# EAGLE design MySensors D1 mini (EAGLE 6.1)
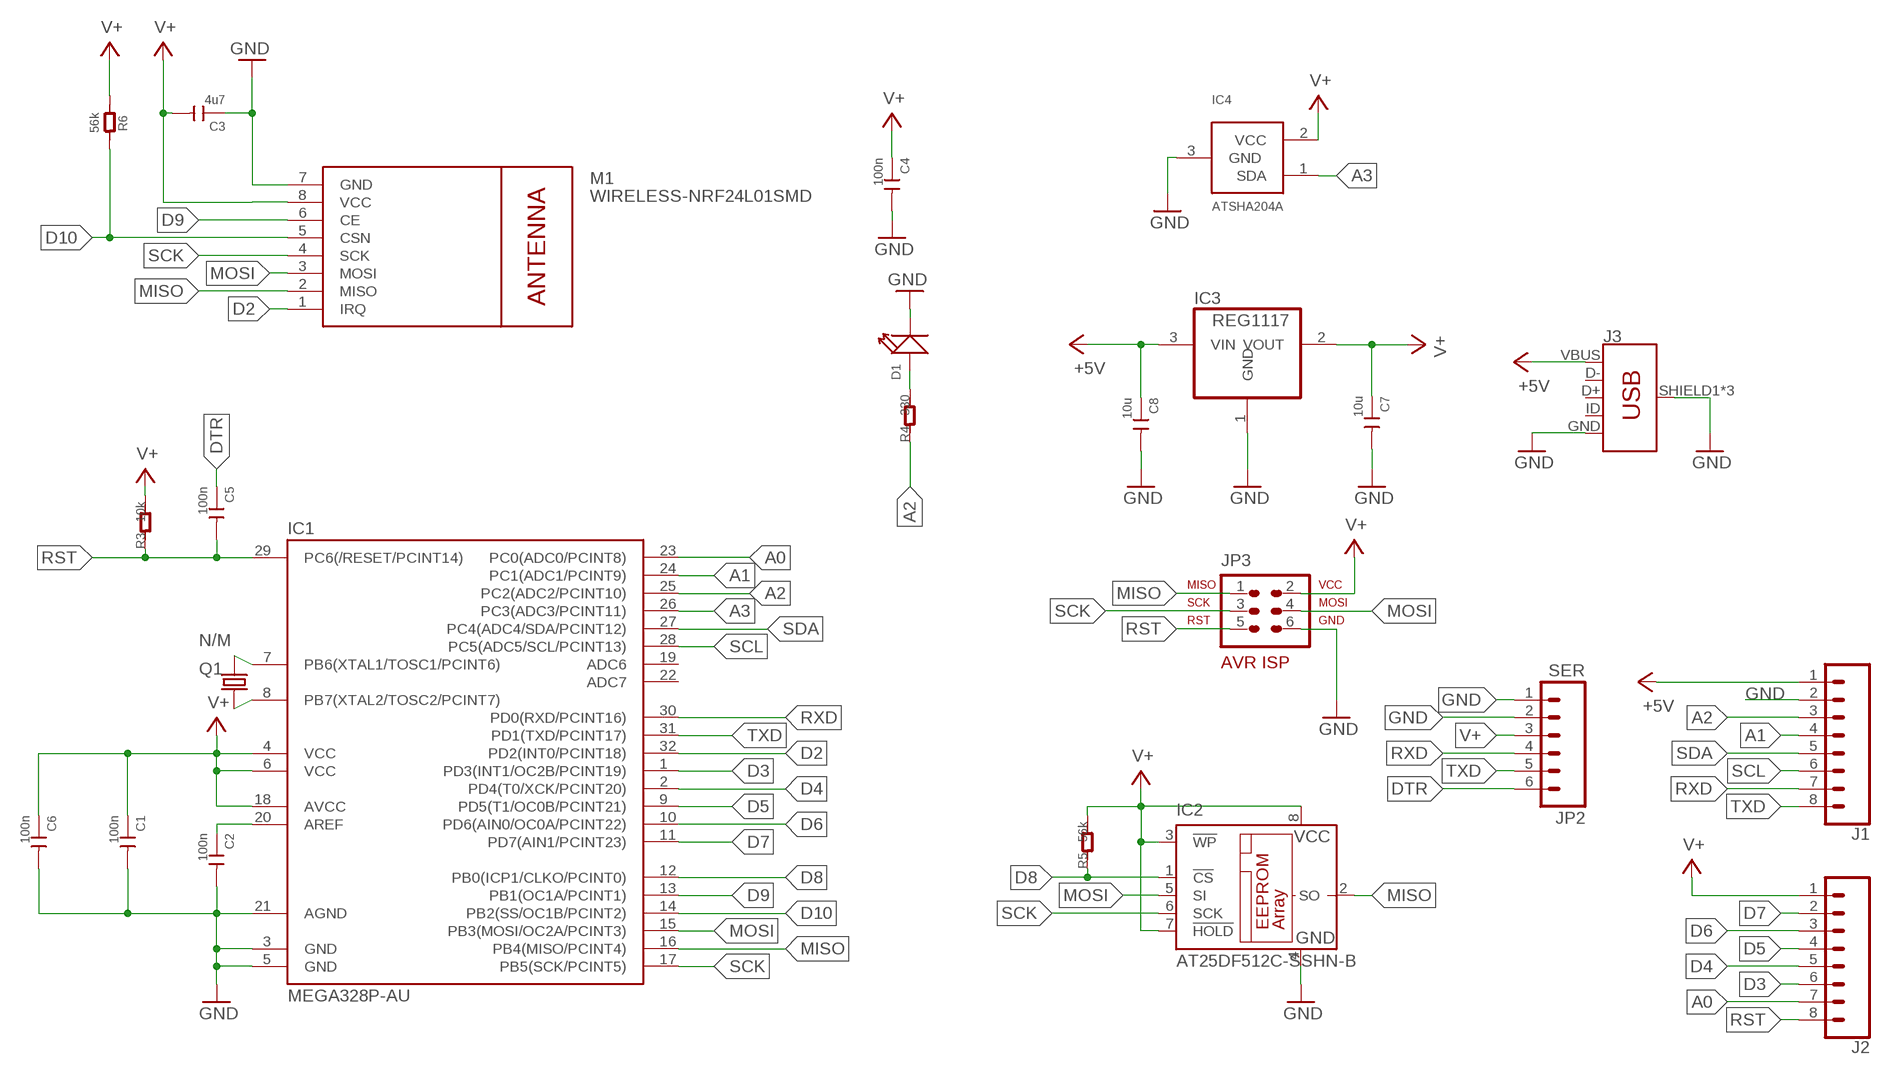
[diagram p0: schematic, sheet 1]

## Parts
C1  100n  CAP-0402  [C0402]
C2  100n  CAP-0402  [C0402]
C3  4u7  CAP-0603  [C0603]
C4  100n  CAP-0402  [C0402]
C5  100n  CAP-0402  [C0402]
C6  100n  CAP-0402  [C0402]
C7  10u  CAP-1206  [C1206]
C8  10u  CAP-1206  [C1206]
D1  LED-0402  [LED-0402]
IC1  MEGA328P-AU  MEGA48/88/168-AU  [TQFP32-08]
IC2  AT25DF512C-SSHN-B  25AA080SN  [SO-08]
IC3  REG1117  [SOT223]
IC4  ATSHA204A  [SOT23]
J1  CONN_08"  [1X08]
J2  CONN_08"  [1X08]
J3  USB_MICRO-B_FEMALE-SMT  [USB-B-MICRO-SMD]
JP2  SER  M06NO_SILK_FEMALE_PTH  [1X06_NO_SILK]
JP3  N/M  AVR-ISP-6VERT  [AVR-ISP-6]
M1  WIRELESS-NRF24L01SMD  [WIRELESS-NRF24L01-SMD]
Q1  N/M  CRYSTAL-306010055  [2P-L3.2XW1.5MM]
R3  10k  R-0402  [R0402]
R4  330  R-0402  [R0402]
R5  56k  R-0402  [R0402]
R6  56k  R-0402  [R0402]

## Nets
+5V [Power]: C8.1 IC3.3(VIN) J1.1 J3.VBUS
A0: IC1.23(PC0(ADC0/PCINT8)) J2.7
A1: IC1.24(PC1(ADC1/PCINT9)) J1.4
A2: IC1.25(PC2(ADC2/PCINT10)) J1.3 R4.1
A3: IC1.26(PC3(ADC3/PCINT11)) IC4.1(SDA)
D2: IC1.32(PD2(INT0/PCINT18)) M1.1(IRQ)
D3: IC1.1(PD3(INT1/OC2B/PCINT19)) J2.6
D4: IC1.2(PD4(T0/XCK/PCINT20)) J2.5
D5: IC1.9(PD5(T1/OC0B/PCINT21)) J2.4
D6: IC1.10(PD6(AIN0/OC0A/PCINT22)) J2.3
D7: IC1.11(PD7(AIN1/PCINT23)) J2.2
D8: IC1.12(PB0(ICP1/CLKO/PCINT0)) IC2.1(!CS) R5.1
D9: IC1.13(PB1(OC1A/PCINT1)) M1.6(CE)
D10: IC1.14(PB2(SS/OC1B/PCINT2)) M1.5(CSN) R6.1
DTR: C5.1 JP2.6
GND [Power]: C1.2 C2.2 C3.1 C4.2 C6.2 C7.2 C8.2 D1.- IC1.3(GND) IC1.5(GND) IC1.21(AGND) IC2.4(GND) IC3.1(GND) IC4.3(GND) J1.2 J3.GND J3.SHIELD1(SHIELD) J3.SHIELD2(SHIELD) J3.SHIELD3(SHIELD) JP2.1 JP2.2 JP3.6 M1.7(GND)
MISO: IC1.16(PB4(MISO/PCINT4)) IC2.2(SO) JP3.1 M1.2(MISO)
MOSI: IC1.15(PB3(MOSI/OC2A/PCINT3)) IC2.5(SI) JP3.4 M1.3(MOSI)
N$1: IC1.7(PB6(XTAL1/TOSC1/PCINT6)) Q1.1
N$2: IC1.8(PB7(XTAL2/TOSC2/PCINT7)) Q1.2
N$3: D1.+ R4.2
N$4: C2.1 IC1.20(AREF)
RST: C5.2 IC1.29(PC6(/RESET/PCINT14)) J2.8 JP3.5 R3.1
RXD: IC1.30(PD0(RXD/PCINT16)) J1.7 JP2.4
SCK: IC1.17(PB5(SCK/PCINT5)) IC2.6(SCK) JP3.3 M1.4(SCK)
SCL: IC1.28(PC5(ADC5/SCL/PCINT13)) J1.6
SDA: IC1.27(PC4(ADC4/SDA/PCINT12)) J1.5
TXD: IC1.31(PD1(TXD/PCINT17)) J1.8 JP2.5
V+ [Power]: C1.1 C3.2 C4.1 C6.1 C7.1 IC1.4(VCC) IC1.6(VCC) IC1.18(AVCC) IC2.3(!WP) IC2.7(!HOLD) IC2.8(VCC) IC3.2(VOUT) IC4.2(VCC) J2.1 JP2.3 JP3.2 M1.8(VCC) R3.2 R5.2 R6.2
Unconnected: IC1.19(ADC6) IC1.22(ADC7) J3.D+ J3.D- J3.ID

## Library data of the parts
C1-C8 = Discrete:CAP: Ceramic Capacitors
D1 = Discrete:LED
IC1 = avr-7:MEGA48/88/168
IC2 = microchip:25*: Serial EEPROM 4K/ 8K , SPI bus; MF: MICROCHIP; MPN: 25AA080/SN; OC_FARNELL: 1816072; OC_NEWARK: 92C7351
IC3 = burr-brown:REG1117: 800mA and 1A Low Dropout (LDO) Positive Regulator 1.8V, 2.5V, 2.85V, 3.3V, 5V, and Adj; MPN: REG1117; OC_FARNELL: 1097566; OC_NEWARK: 14P6981
IC4 = Sensor:ATSHA204A
J1 J2 = SparkFun-Connectors:CONN_08: Multi connection point. Often used as Generic Header-pin footprint for 0.1 inch spaced/style header connections On any of the 0.1 inch spaced packages, you can populate with these: Break Away Headers - Straight <https://www.sparkfun.com/products/116> (PRT-00116) Break Away Male Headers - Right Angle <https://www.sparkfun.com/products/553> (PRT-00553) Female Headers <https://www.sparkfun.com/products/115> (PRT-00115) Break Away Headers - Machine Pin <https://www.sparkfun.com/products/117> (PRT-00117) Break Away Female Headers - Swiss Machine Pin <https://www.sparkfun.com/products/743> (PRT-00743) Arduino Stackable Header - 8 Pin <https://www.sparkfun.com/products/9279> (PRT-09279) For SCREWTERMINALS and SPRING TERMINALS visit here: Screw Terimnals on SparkFun.com <https://www.sparkfun.com/search/results?term=Screw+Terminals> (5mm/3.5mm/2.54mm spacing) This device is also useful as a general connection point to wire up your design to another part of your project. Our various solder wires solder well into these plated through hole pads. Hook-Up Wire - Assortment (Stranded, 22 AWG) <https://www.sparkfun.com/products/11375> (PRT-11375) Hook-Up Wire - Assortment (Solid Core, 22 AWG) <https://www.sparkfun.com/products/11367> (PRT-11367) View the entire wire category on our website here <https://www.sparkfun.com/categories/141> Special notes: Molex polarized connector foot print use with SKU : PRT-08231 with associated crimp pins and housings. 1MM SMD Version SKU: PRT-10208 NOTES ON THE VARIANTS LOCK and LOCK_LONGPADS... This footprint was designed to help hold the alignment of a through-hole component (i.e. 6-pin header) while soldering it into place. You may notice that each hole has been shifted either up or down by 0.005 of an inch from it's more standard position (which is a perfectly straight line). This slight alteration caused the pins (the squares in the middle) to touch the edges of the holes. Because they are alternating, it causes a "brace" to hold the component in place. 0.005 has proven to be the perfect amount of "off-center" position when using our standard breakaway headers. Although looks a little odd when you look at the bare footprint, once you have a header in there, the alteration is very hard to notice. Also,if you push a header all the way into place, it is covered up entirely on the bottom side.; PROD_ID: CONN-08438
J3 = SparkFun-Connectors:USB_MICRO-B: USB Type Micro-B Connector Male/female and PTH/SMT variants SparkFun Products: SparkFun microB USB Breakout <https://www.sparkfun.com/products/12035> SparkFun USB microB Plug Breakout <https://www.sparkfun.com/products/10031> SparkFun ESP8266 Thing <https://www.sparkfun.com/products/13231>; PROD_ID: CONN-11752
JP2 = SparkFun-Connectors:M06: Header 6 Standard 6-pin 0.1" header. Use with straight break away headers (SKU : PRT-00116), right angle break away headers (PRT-00553), swiss pins (PRT-00743), machine pins (PRT-00117), and female headers (PRT-00115). Molex polarized connector foot print use with SKU : PRT-08094 with associated crimp pins and housings. NOTES ON THE VARIANTS LOCK and LOCK_LONGPADS... This footprint was designed to help hold the alignment of a through-hole component (i.e. 6-pin header) while soldering it into place. You may notice that each hole has been shifted either up or down by 0.005 of an inch from it's more standard position (which is a perfectly straight line). This slight alteration caused the pins (the squares in the middle) to touch the edges of the holes. Because they are alternating, it causes a "brace" to hold the component in place. 0.005 has proven to be the perfect amount of "off-center" position when using our standard breakaway headers. Although looks a little odd when you look at the bare footprint, once you have a header in there, the alteration is very hard to notice. Also,if you push a header all the way into place, it is covered up entirely on the bottom side. This idea of altering the position of holes to aid alignment will be further integrated into the Sparkfun Library for other footprints. It can help hold any component with 3 or more connection pins.; PROD_ID: CONN-08437
JP3 = avr-7:AVR-ISP-6: AVR ISP-6 Serial Programming Header
M1 = nrf24l01plus:WIRELESS-NRF24L01: 2.4 GHz Wireless Module based on NRF24L01 chip
Q1 = Discrete:CRYSTAL*
R3-R6 = Discrete:R*

## Net classes
0 default: width 0.203 mm
1 Power: width 0.406 mm

## Board
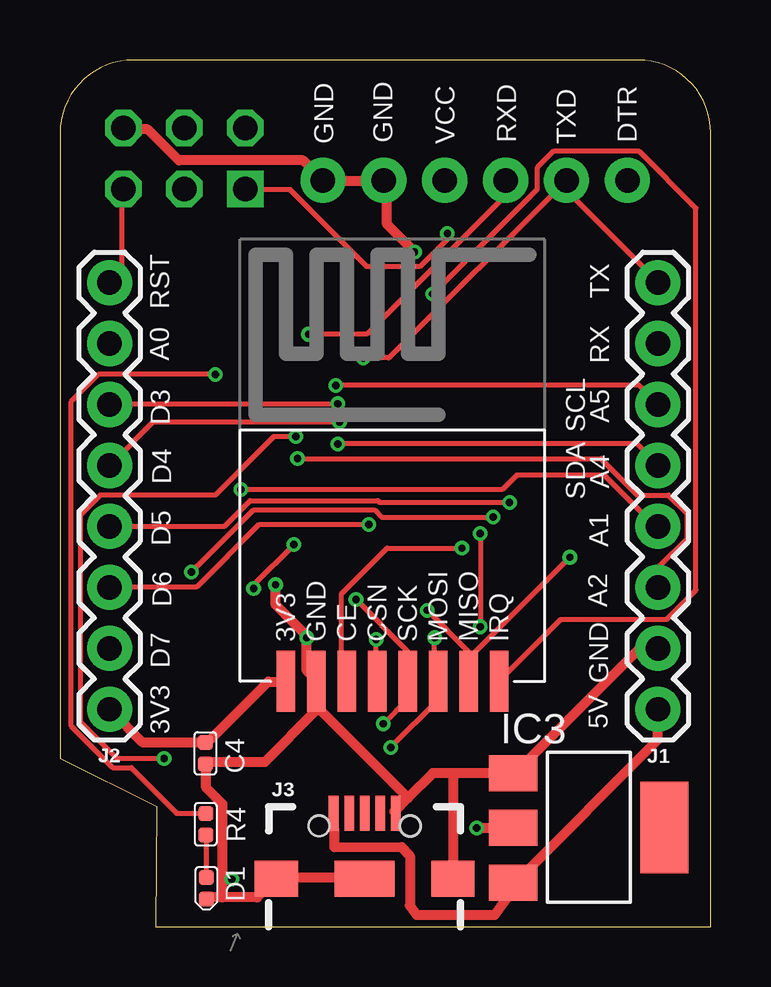
[diagram p1: board, top side]
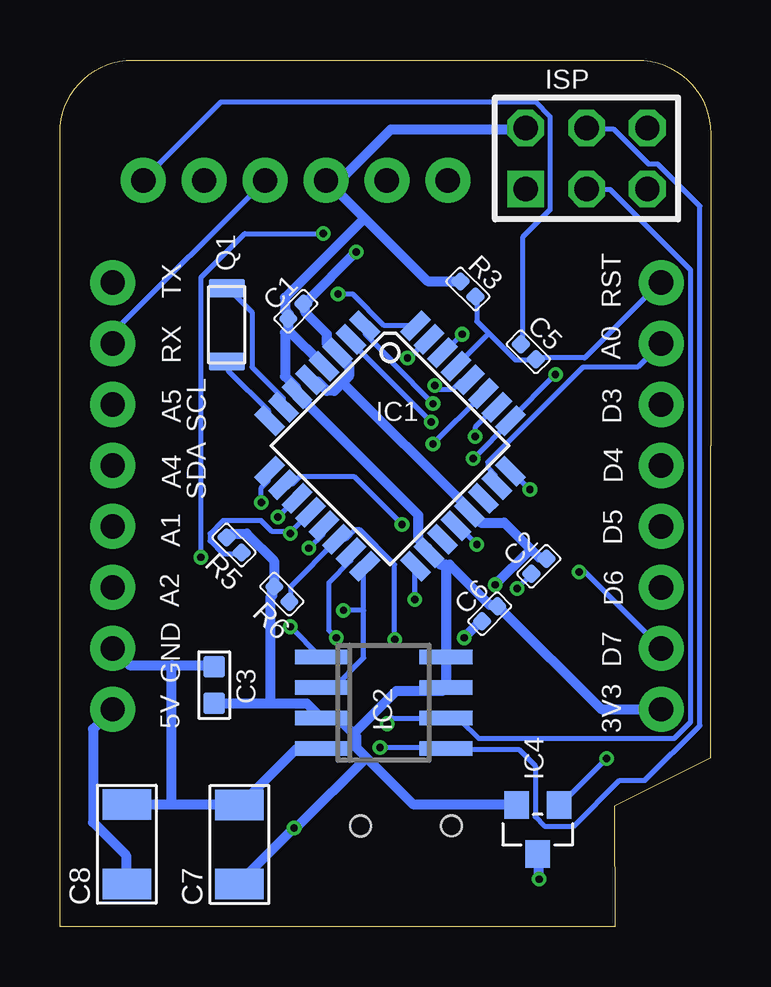
[diagram p2: board, bottom side, seen from below]

Size 27.13 x 36.11 mm. Coordinates in mm from the lower left corner, seen from the top.
Outline: 4.03,5.02 4,0 27.13,0 27.13,33.08 arc90 24.1,36.11 3.07,36.11 arc90 0,33.04 0.02,7.02 4.03,5.02
Copper layers (1*16): Top 0.035mm / dielectric 1.5mm / Bottom 0.035mm
Design rules: minimum track width 6mil, minimum drill 12mil, track to track 6mil, track to pad 6mil, pad to pad 6mil, via to via 6mil, smd to smd 0mil, copper to edge 10mil, drill to drill 10mil, minimum pad ring 10mil, minimum via ring 6mil, stop-mask expansion 2mil, vias tented up to drill 100mil, thermal gap 10mil
Holes 0.86 mm at 10.81,4.2 14.6,4.2

### Footprints (pad centres in the part's own frame; a part is rotated, then mirrored left to right if it is on the bottom)
C0402 = smd 0.635 x 0.635: 1 -0.445,0; 2 0.445,0
C0603 = smd 0.889 x 0.889: 1 -0.762,0; 2 0.762,0
C1206 = smd 1.27 x 2.032: 1 -1.651,0; 2 1.651,0
LED-0402 = smd 0.635 x 0.635: + -0.445,0; - 0.445,0
TQFP32-08 = smd 1.27 x 0.559: 1 -4.293,2.8; 2 -4.293,2; 3 -4.293,1.2; 4 -4.293,0.4; 5 -4.293,-0.4; 6 -4.293,-1.2; 7 -4.293,-2; 8 -4.293,-2.8; 17 4.293,-2.8; 18 4.293,-2; 19 4.293,-1.2; 20 4.293,-0.4; 21 4.293,0.4; 22 4.293,1.2; 23 4.293,2; 24 4.293,2.8 | smd 0.559 x 1.27: 9 -2.8,-4.293; 10 -2,-4.293; 11 -1.2,-4.293; 12 -0.4,-4.293; 13 0.4,-4.293; 14 1.2,-4.293; 15 2,-4.293; 16 2.8,-4.293; 25 2.8,4.293; 26 2,4.293; 27 1.2,4.293; 28 0.4,4.293; 29 -0.4,4.293; 30 -1.2,4.293; 31 -2,4.293; 32 -2.8,4.293
SO-08 = smd 0.6 x 2.2: 1 -1.905,-2.6; 2 -0.635,-2.6; 3 0.635,-2.6; 4 1.905,-2.6; 5 1.905,2.6; 6 0.635,2.6; 7 -0.635,2.6; 8 -1.905,2.6
SOT223 = smd 1.499 x 2.007: 1 -2.261,-3.15; 2 0.025,-3.15; 3 2.311,-3.15 | smd 3.81 x 2.007: 4 0,3.15
SOT23 = smd 1.016 x 1.143: 1 -0.889,-1.016; 2 0.889,-1.016; 3 0,1.016
1X08 = drill 1.016 pad 1.88: 1 0,0; 2 2.54,0; 3 5.08,0; 4 7.62,0; 5 10.16,0; 6 12.7,0; 7 15.24,0; 8 17.78,0
USB-B-MICRO-SMD = smd 1.45 x 0.4: D+ 2.725,0; D- 2.725,0.65; GND 2.725,-1.3; ID 2.725,-0.65; VBUS 2.725,1.3 | smd 1.5 x 1.8: SHIELD1 0,3.685; SHIELD2 0,-3.685 | smd 1.5 x 2.5: SHIELD3 0,0 | hole 0.85: 2.2,1.9; 2.2,-1.9
1X06_NO_SILK = drill 1.016 pad 1.88: 1 0,0; 2 2.54,0; 3 5.08,0; 4 7.62,0; 5 10.16,0; 6 12.7,0
AVR-ISP-6 = drill 1.016 square: 1 -2.54,-1.27 | drill 1.016 octagon: 2 -2.54,1.27; 3 0,-1.27; 4 0,1.27; 5 2.54,-1.27; 6 2.54,1.27
WIRELESS-NRF24L01-SMD = smd 2.54 x 0.762: 1 1.27,0; 2 1.27,1.27; 3 1.27,2.54; 4 1.27,3.81; 5 1.27,5.08; 6 1.27,6.35; 7 1.27,7.62; 8 1.27,8.89
2P-L3.2XW1.5MM = smd 0.762 x 1.524: 1 -1.524,0; 2 1.524,0
R0402 = smd 0.635 x 0.635: 1 0,0.445; 2 0,-0.445

### Placement (x,y rotation side)
C1  17.3,25.64 45 bottom
C2  7.17,15.02 45 bottom
C3  20.7,10.06 270 bottom
C4  6.06,7.22 270 top
C5  7.61,23.95 315 bottom
C6  9.22,13.04 225 bottom
C7  19.65,3.42 90 bottom
C8  24.35,3.44 90 bottom
D1  6.1,1.6 270 top
IC1  13.37,20.03 315 bottom
IC2  13.64,9.34 270 bottom
IC3  22.05,4.14 270 top
IC4  7.21,4.05 180 bottom
J1  24.93,9.06 90 top
J2  2.07,9.06 90 top
J3  12.71,2 90 top
JP2  10.96,31.1 180 bottom
JP3  5.18,32.02 0 bottom
M1  18.31,8.95 90 top
Q1  20.18,25.08 270 bottom
R3  10.13,26.57 225 bottom
R4  6.08,4.27 0 top
R5  19.88,15.9 225 bottom
R6  17.88,13.86 225 bottom

### Tracks (layer width: path | path; a pad name or v marks a point on that pad's centre or on a via)
+5V
  Top 0.406: J3.VBUS 11.43,3.52 11.43,3.32 14.25,3.33 14.59,2.95 14.59,0.88 14.87,0.5 18.13,0.5 18.7,1.26 18.9,1.29 IC3.3 19.05,1.91 24.92,7.77 24.92,8.99 J1.1
  Bottom 0.406: C8.1 24.38,1.83 24.38,2.97 25.75,4.34 25.75,8.23 24.99,8.99 J1.1
A0
  Bottom 0.203: IC1.23 8.99,18.44 8.99,18.82 9.29,19.13 9.29,19.36 5.33,23.32 3.05,23.32 2.13,24.23 J2.7
A1  (via drill 0.3)
  Top 0.203: v7.54,18.21 18.44,18.21 19.05,18.82 22.71,18.82 24.92,16.61 J1.4
  Bottom 0.203: v7.54,18.21 8.3,18.97 IC1.24
A2  (via drill 0.3)
  Top 0.203: v6.48,23.01 1.6,23.01 0.46,21.87 0.46,8.38 2.21,6.63 2.97,6.63 4.88,4.72 6.02,4.72 R4.1 | v9.9,19.51 22.55,19.51 24.08,17.98 25.37,17.98 26.14,17.22 26.14,16.15 24.99,15.01 24.99,14.17 J1.3
  Bottom 0.203: v6.48,23.01 8.38,21.11 IC1.25 8.38,21.03 v9.9,19.51
A3  (via drill 0.3)
  Top 0.203: v4.34,7.01 2.36,7.01 0.84,8.53 0.84,17.14 1.67,17.98 6.48,17.98 8.91,20.42 v9.83,20.42
  Bottom 0.203: v4.34,7.01 6.25,5.11 IC4.1 | v9.83,20.42 9.83,20.8 8.99,21.64 IC1.26
D2  (via drill 0.3)
  Top 0.203: v15.54,26.36 19.89,30.71 19.89,31.62 20.57,32.31 24.15,32.31 26.52,29.95 26.52,14.02 25.3,12.8 20.88,12.8 18.36,10.29 M1.1
  Bottom 0.203: v15.54,26.36 14.93,26.36 13.64,25.07 12.34,25.07 IC1.32
D3  (via drill 0.3)
  Top 0.203: v11.58,21.79 2.13,21.79 J2.6
  Bottom 0.203: v11.58,21.79 13.26,23.47 13.26,23.55 14.4,24.69 14.4,24.99 IC1.1
D4  (via drill 0.3)
  Top 0.203: v11.66,21.03 3.88,21.03 2.13,19.28 J2.5
  Bottom 0.203: v11.66,21.03 14.93,24.31 14.93,24.46 IC1.2
D5  (via drill 0.3)
  Top 0.203: v18.74,17.68 13.33,17.68 13.26,17.75 7.92,17.75 6.86,16.69 2.13,16.69 J2.4
  Bottom 0.203: v18.74,17.68 18.74,18.29 18.44,18.59 18.44,18.97 IC1.9
D6  (via drill 0.3)
  Top 0.203: v12.88,16.76 8.3,16.76 5.71,14.17 2.13,14.17 J2.3
  Bottom 0.203: v12.88,16.76 14.86,18.75 17.14,18.75 17.45,18.44 17.75,18.44 IC1.10
D7  (via drill 0.3)
  Top 0.203: v18.06,17.07 13.41,17.07 13.1,17.37 8.08,17.37 v5.48,14.78
  Bottom 0.203: v18.06,17.07 17.3,17.83 IC1.11 | v5.48,14.78 5.26,14.78 2.13,11.66 J2.2
D8  (via drill 0.3)
  Top 0.203: v17.52,16.38 v17.52,12.5
  Bottom 0.203: 17.52,16.46 18.29,16.46 18.74,16.92 20.34,16.92 20.88,16.38 20.88,16.08 20.34,15.54 19.58,15.54 R5.1 | 17.52,16.46 16.76,17.22 IC1.12 | v17.52,12.5 16.31,11.28 IC2.1 | v17.52,16.38 17.52,16.46
D9  (via drill 0.3)
  Top 0.203: v16.76,15.77 13.64,15.77 11.73,13.87 11.73,10.52 11.96,10.29 M1.6
  Bottom 0.203: v16.76,15.77 16.15,16.38 16.15,16.69 IC1.13
D10  (via drill 0.3)
  Top 0.203: v13.18,11.96 13.18,10.29 M1.5
  Bottom 0.203: R6.1 17.52,13.56 17.52,14.17 15.62,16.08 IC1.14 15.47,16.15 15.24,16.15 14.86,16.54 14.63,16.54 13.18,15.09 v13.18,11.96
DTR
  Bottom 0.203: C5.1 7.85,24.31 7.85,28.73 6.7,29.87 6.7,33.76 7.31,34.37 20.42,34.37 23.62,31.17 JP2.6
GND  (via drill 0.3)
  Top 0.406: JP3.6 2.67,33.22 3.66,33.22 4.95,31.93 10.13,31.93 10.9,31.17 JP2.1 11.12,31.09 13.49,31.09 JP2.2 13.64,30.94 13.64,29.26 v14.78,28.12 | 6.78,1.22 8.23,1.22 8.99,1.98 J3.SHIELD1 9.22,2.06 12.65,2.06 J3.SHIELD3 | 6.78,1.22 6.17,1.22 D1.- | 6.78,1.22 6.78,1.98 | 6.78,1.98 6.78,5.11 6.09,5.79 6.09,6.71 C4.2 6.25,6.86 8.53,6.86 10.67,8.99 M1.7 | 6.78,1.98 v7.16,1.98 | M1.7 10.67,10.29 10.29,10.67 v10.29,12.04 10.21,12.19 8.99,13.41 v8.99,14.25 | 10.74,10.21 M1.7 | 14.51,5.37 15.54,6.4 16.38,6.4 | 14.51,5.37 13.94,4.8 J3.GND | 16.38,6.4 IC3.1 19.05,6.48 24.15,11.58 24.92,11.58 J1.2 | 16.38,6.4 16.38,2.06 J3.SHIELD2 | 14.51,5.37 10.82,9.07 10.82,10.06 M1.7
  Bottom 0.406: 22.48,10.9 24.23,10.9 24.92,11.58 J1.2 | 22.48,10.9 20.72,10.9 C3.1 | 22.48,5.11 24.31,5.11 C8.2 | 22.48,5.11 19.66,5.11 C7.2 19.51,5.18 17.3,7.39 16.31,7.39 IC2.4 | 22.48,5.11 22.48,10.9 | 15.35,22.67 15.09,22.94 15.09,23.39 15.47,23.77 IC1.3 15.62,23.93 16,24.31 16,24.69 16.91,25.6 16.91,25.91 C1.2 16.84,26.06 v14.78,28.12 | 15.35,22.67 15.7,22.33 16,22.33 16.38,22.71 16.69,22.71 IC1.5 | 7.5,15.73 8.61,16.84 9.6,16.84 9.98,17.22 IC1.21 10.13,17.45 15.35,22.67 | 7.5,15.73 7.16,15.39 6.86,15.39 C2.2 | v7.16,1.98 7.16,2.97 IC4.3 | v10.29,12.04 9.6,12.72 C6.2 | v8.99,14.25 7.5,15.73
MISO  (via drill 0.3)
  Top 0.203: v15.31,13.18 16.99,11.51 16.99,10.29 M1.2 17.07,11.2 v21.26,15.39 | v16.15,28.88 16.15,28.65 15.01,27.51 12.8,27.51 9.6,30.71 7.77,30.71 JP3.1
  Bottom 0.203: 14.48,13.18 14.48,11.2 15.7,9.98 16.23,9.98 IC2.2 | 14.48,13.18 14.48,15.01 IC1.16 | 14.48,13.18 v15.31,13.18 | v16.15,28.88 19.43,28.88 21.26,27.05 v21.26,15.39
MOSI  (via drill 0.3)
  Top 0.203: v15.62,12.04 15.62,10.44 15.77,10.29 M1.3 15.77,10.13 15.77,9.45 v13.79,7.47
  Bottom 0.203: v15.62,12.04 15.92,12.34 15.92,14.33 15.01,15.24 15.01,15.54 IC1.15 | v13.79,7.47 11.05,7.47 IC2.5 10.97,7.39 8,7.39 7.31,6.71 7.31,4.57 6.93,4.19 5.71,4.19 3.81,6.1 2.74,6.1 0.46,8.38 0.46,30.02 2.21,31.77 2.59,31.77 4.04,33.22 5.18,33.22 JP3.4
N$1
  Bottom 0.203: IC1.7 17.83,21.72 17.83,22.02 19.12,23.32 19.12,25.6 20.12,26.59 Q1.1
N$2
  Bottom 0.203: IC1.8 18.44,21.11 18.44,21.49 20.12,23.16 20.12,23.55 Q1.2
N$3
  Top 0.203: D1.+ 6.09,3.81 R4.2
N$4  (via drill 0.3)
  Top 0.203: v8.08,14.1 8.08,14.25 v9.75,15.93
  Bottom 0.203: v8.08,14.1 7.54,14.63 C2.1 | v9.75,15.93 10.59,16.76 IC1.20
RST
  Top 0.203: JP3.5 2.59,30.71 2.59,27.36 2.13,26.9 J2.8
  Bottom 0.203: 9.26,24.73 9.75,25.22 9.75,26.21 R3.1 | 9.26,24.73 8.15,23.62 7.31,23.62 C5.2 7.24,23.7 5.26,23.7 2.13,26.82 J2.8 | 9.26,24.73 10.59,23.39 IC1.29
RXD  (via drill 0.3)
  Top 0.203: v10.36,24.69 12.8,24.69 18.52,30.4 18.52,31.09 JP2.4
  Bottom 0.203: v10.36,24.69 11.12,23.93 IC1.30 | J1.7 24.92,24.31 24.92,24.77 18.59,31.09 JP2.4
SCK  (via drill 0.3)
  Top 0.203: v12.34,13.64 14.48,11.51 14.48,10.29 M1.4 14.48,10.13 14.48,9.45 v13.49,8.46
  Bottom 0.203: v12.34,13.64 12.34,15.01 IC1.17 | v13.49,8.46 13.26,8.69 11.05,8.69 IC2.6 10.97,8.61 10.44,8.61 9.68,7.85 1.52,7.85 0.84,8.53 0.84,27.36 4.19,30.71 5.18,30.71 JP3.3
SCL  (via drill 0.3)
  Top 0.203: v11.5,22.55 24.15,22.55 24.92,21.79 J1.6
  Bottom 0.203: v11.5,22.55 11.35,22.4 10.74,22.4 10.44,22.71 10.06,22.71 IC1.28
SDA  (via drill 0.3)
  Top 0.203: v11.58,20.12 24.08,20.12 24.92,19.28 J1.5
  Bottom 0.203: v11.58,20.12 9.52,22.17 IC1.27
TXD  (via drill 0.3)
  Top 0.203: v12.65,23.7 13.71,23.7 21.11,31.09 JP2.5 20.95,30.86 24.92,26.9 J1.8
  Bottom 0.203: v12.65,23.7 12.57,23.7 11.81,24.46 IC1.31
V+  (via drill 0.3)
  Top 0.406: J2.1 2.13,8.99 3.43,7.7 6.02,7.7 C4.1 6.25,7.77 8.69,10.21 9.37,10.21 M1.8 | v17.37,4.12 IC3.2
  Bottom 0.406: 17.6,24.84 17.6,25.3 C1.1 17.6,25.53 17.75,25.68 17.75,26.21 14.44,29.53 | 17.6,24.84 16.15,23.39 IC1.4 | 17.6,24.84 17.75,24.77 17.75,22.94 17.3,22.48 17.3,22.25 IC1.6 17.14,22.1 12.19,17.14 12.19,16.15 11.81,15.77 IC1.18 11.73,15.54 11.28,15.09 11.05,15.09 | 14.44,29.53 16,31.09 JP2.3 15.62,30.94 13.33,33.22 7.77,33.22 JP3.2 | 14.44,29.53 11.81,26.9 10.51,26.9 R3.2 | 11.05,15.09 10.9,15.09 9.22,13.41 8.91,13.41 C6.1 8.76,13.26 4.57,9.07 2.13,9.07 J2.1 | 11.05,15.09 11.05,11.43 IC2.8 11.05,11.2 11.05,9.98 IC2.7 11.2,9.83 13.1,9.83 14.9,8.04 | C7.1 19.66,1.83 v17.37,4.12 17.22,4.19 14.36,7.05 | R5.2 20.12,16.23 19.96,16.38 19.35,16.38 18.21,15.24 18.21,14.25 R6.2 18.29,14.02 18.29,13.79 18.36,13.72 18.36,9.3 | 18.36,9.3 16.84,9.3 16.31,8.76 IC2.3 16.08,8.61 15.47,8.61 14.9,8.04 | 18.36,9.3 20.65,9.3 C3.2 | 14.36,7.05 14.78,7.47 14.78,7.92 14.9,8.04 | 14.36,7.05 12.42,5.11 8.15,5.11 IC4.2

### Text on the board
tPlace: RST | TX | A0 | RX | SCL | D3 | A5 | D4 | SDA | A4 | D5 | A1 | D6 | A2 | GND | D7 | 3V3 | 5V
bPlace: RST | TX | A0 | RX | SCL | D3 | A5 | D4 | SDA | A4 | D5 | A1 | D6 | A2 | GND | D7 | 3V3 | 5V
tNames: GND | GND | VCC | RXD | TXD | DTR
bNames: ISP